# Altium schematic sheet Modules2_v3.SchDoc
size A4; Author: Luis Sanchez Velasco
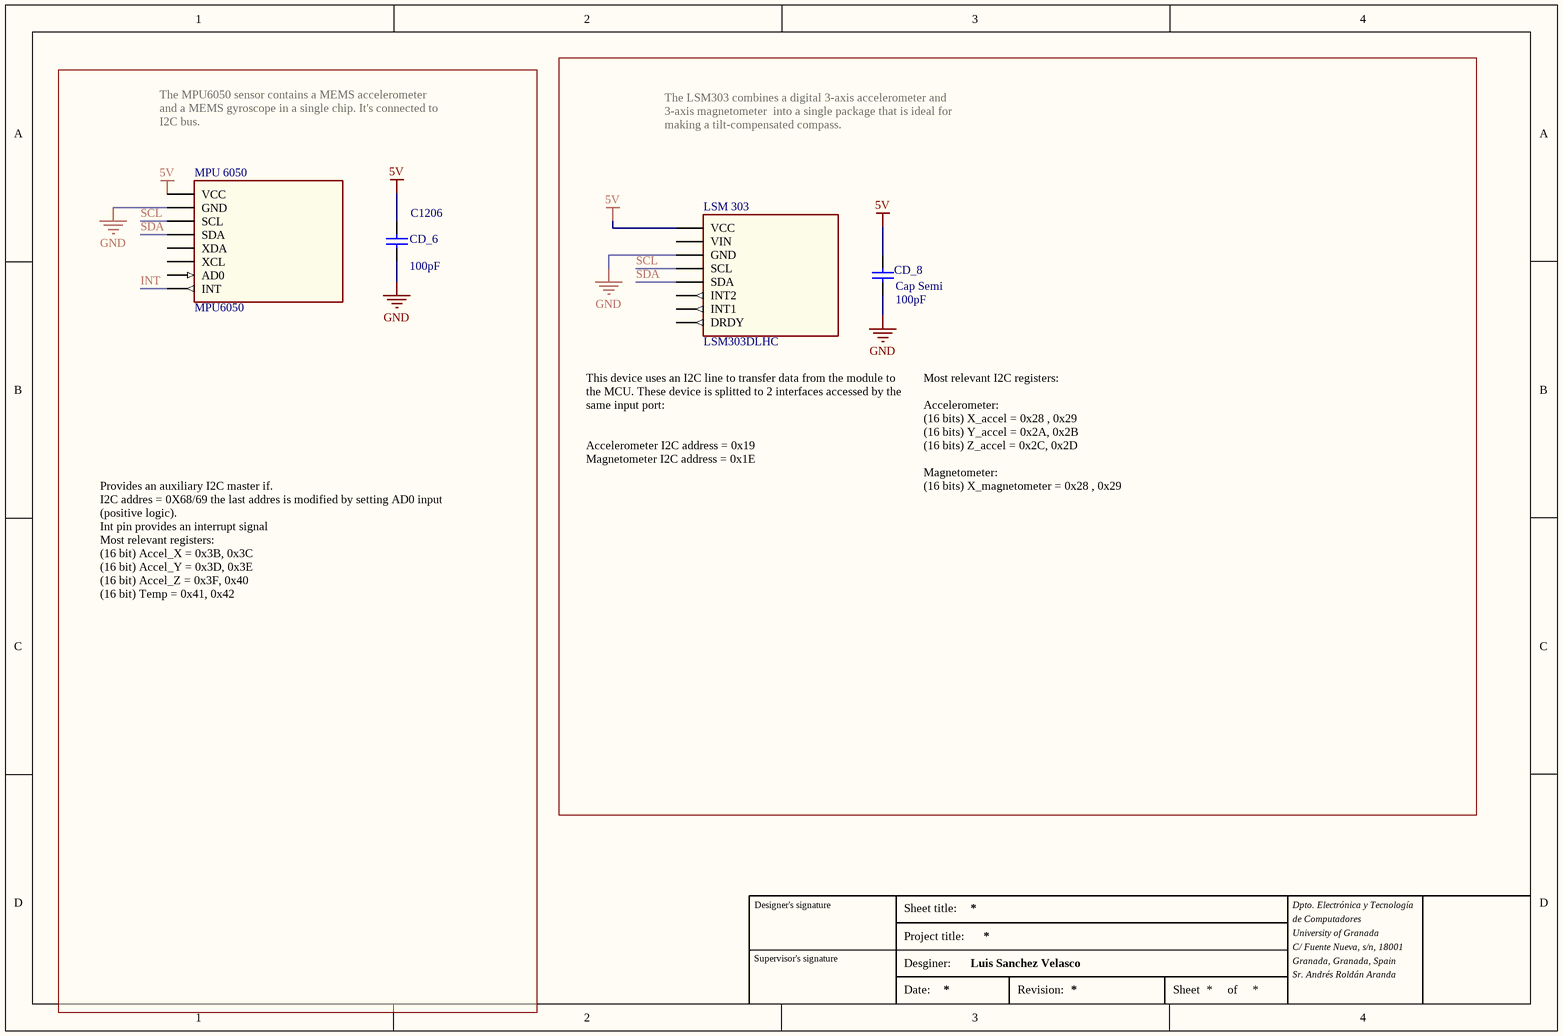
[diagram p0: Modules2_v3.SchDoc]

## Parts
CD_6  value 100pF  [C1206]  (hidden comment: Cap Semi)
CD_8  Cap Semi  value 100pF  [C1206]
LSM_303  LSM303DLHC  [1X08 - LSM303]
MPU_6050  MPU6050  [1X08 - MPU6050]

## Nets
5V: CD_6.2 CD_8.2 LSM_303.VCC MPU_6050.VCC
GND: CD_6.1 CD_8.1 LSM_303.GND MPU_6050.GND
INT: MPU_6050.INT
SCL: LSM_303.SCL MPU_6050.SCL
SDA: LSM_303.SDA MPU_6050.SDA

Not connected (* = marked no-connect by the designer): LSM_303 DRDY INT1 INT2 VIN; MPU_6050 AD0 XCL XDA

## Notes on the sheet
- (near MPU_6050) The MPU6050 sensor contains a MEMS accelerometer and a MEMS gyroscope in a single chip. It's connected to I2C bus.
- (near LSM_303) The LSM303 combines a digital 3-axis accelerometer and 3-axis magnetometer  into a single package that is ideal for making a tilt-compensated compass.
- (near LSM_303) This device uses an I2C line to transfer data from the module to the MCU. These device is splitted to 2 interfaces accessed by the same input port:
  Accelerometer I2C address = 0x19
  Magnetometer I2C address = 0x1E
- Most relevant I2C registers:
  Accelerometer:
  (16 bits) X_accel = 0x28 , 0x29
  (16 bits) Y_accel = 0x2A, 0x2B
  (16 bits) Z_accel = 0x2C, 0x2D
  Magnetometer:
  (16 bits) X_magnetometer = 0x28 , 0x29
  (16 bits) Y_magnetometer = 0x2A, 0x2B
  (16 bits) Z_magnetometer = 0x2C, 0x2D
- Provides an auxiliary I2C master if.
  I2C addres = 0X68/69 the last addres is modified by setting AD0 input (positive logic).
  Int pin provides an interrupt signal
  Most relevant registers:
  (16 bit) Accel_X = 0x3B, 0x3C
  (16 bit) Accel_Y = 0x3D, 0x3E
  (16 bit) Accel_Z = 0x3F, 0x40
  (16 bit) Temp = 0x41, 0x42
  (16 bit) Gyro_X = 0x43, 0x44
  (16 bit) Gyro_Y = 0x45, 0x46
  (16 bit) Gyro_Z = 0x47, 0x48
- Designer's signature
- Sheet title:
- Dpto. Electrónica y Tecnología
- de Computadores
- Supervisor's signature
- Project title:
- Desginer:
- University of Granada
- C/ Fuente Nueva, s/n, 18001
- Granada, Granada, Spain
- Sr. Andrés Roldán Aranda
- Date:
- Revision:
- Sheet
- of

## Library data of the parts
CD_6 CD_8 = Cap Semi: Capacitor (Semiconductor SIM Model); Published: 8-Jun-2000; LatestRevisionDate: 29-May-2009; LatestRevisionNote: IPC-7351 Footprint Added.; PackageReference: C1206; Publisher: Altium Limited; PackageDescription: Chip Capacitor; Supplier 1: Digi-Key
LSM_303 = LSMsimple: Header, 8-Pin; LatestRevisionDate: 17-Jul-2002; LatestRevisionNote: Re-released for DXP Platform.; Publisher: Altium Limited
MPU_6050 = MPUsimple: Header, 8-Pin; LatestRevisionDate: 17-Jul-2002; LatestRevisionNote: Re-released for DXP Platform.; Publisher: Altium Limited